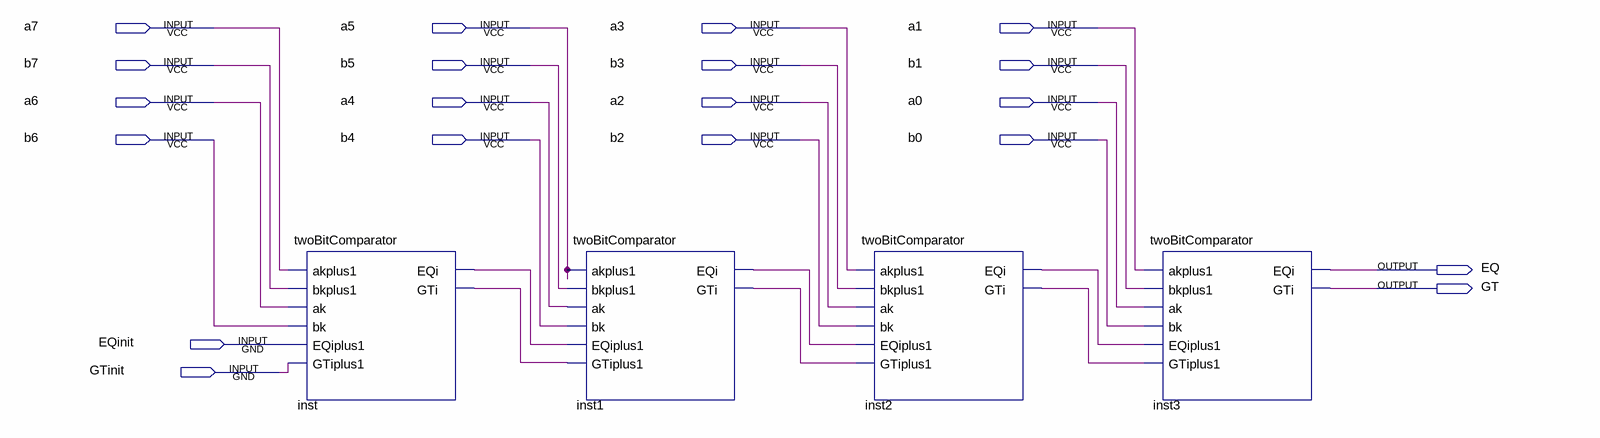
[diagram p0: schematic sheet]
// Quartus schematic eightBitComparator.bdf as structural Verilog: 4 symbols, 20 pins
module eightBitComparator (
  input  a7,
  input  a5,
  input  a3,
  input  a1,
  input  b7,
  input  b5,
  input  b3,
  input  b1,
  input  a6,
  input  a4,
  input  a2,
  input  a0,
  input  b6,
  input  b4,
  input  b2,
  input  b0,
  input  EQinit,
  input  GTinit,
  output EQ,
  output GT
);

  wire inst1_eqi, inst1_gti, inst2_eqi, inst2_gti, inst_eqi, inst_gti;

  twoBitComparator inst (
    .akplus1(a7), .bkplus1(b7), .ak(a6), .bk(b6), .EQiplus1(EQinit), .GTiplus1(GTinit), .EQi(inst_eqi),
    .GTi(inst_gti));
  twoBitComparator inst1 (
    .akplus1(a5), .bkplus1(b5), .ak(a4), .bk(b4), .EQiplus1(inst_eqi), .GTiplus1(inst_gti), .EQi(inst1_eqi),
    .GTi(inst1_gti));
  twoBitComparator inst2 (
    .akplus1(a3), .bkplus1(b3), .ak(a2), .bk(b2), .EQiplus1(inst1_eqi), .GTiplus1(inst1_gti),
    .EQi(inst2_eqi), .GTi(inst2_gti));
  twoBitComparator inst3 (
    .akplus1(a1), .bkplus1(b1), .ak(a0), .bk(b0), .EQiplus1(inst2_eqi), .GTiplus1(inst2_gti), .EQi(EQ),
    .GTi(GT));
endmodule
